# Altium schematic sheet CAN_ADM3053.SchDoc
size 420 x 297 mm; Address1: Address1; Address2: Address2; Address3: Address3; Address4: Address4; SheetNumber: 1; Scale: 1:1; Обозначение документа: АБВГ.123456.001 Э3
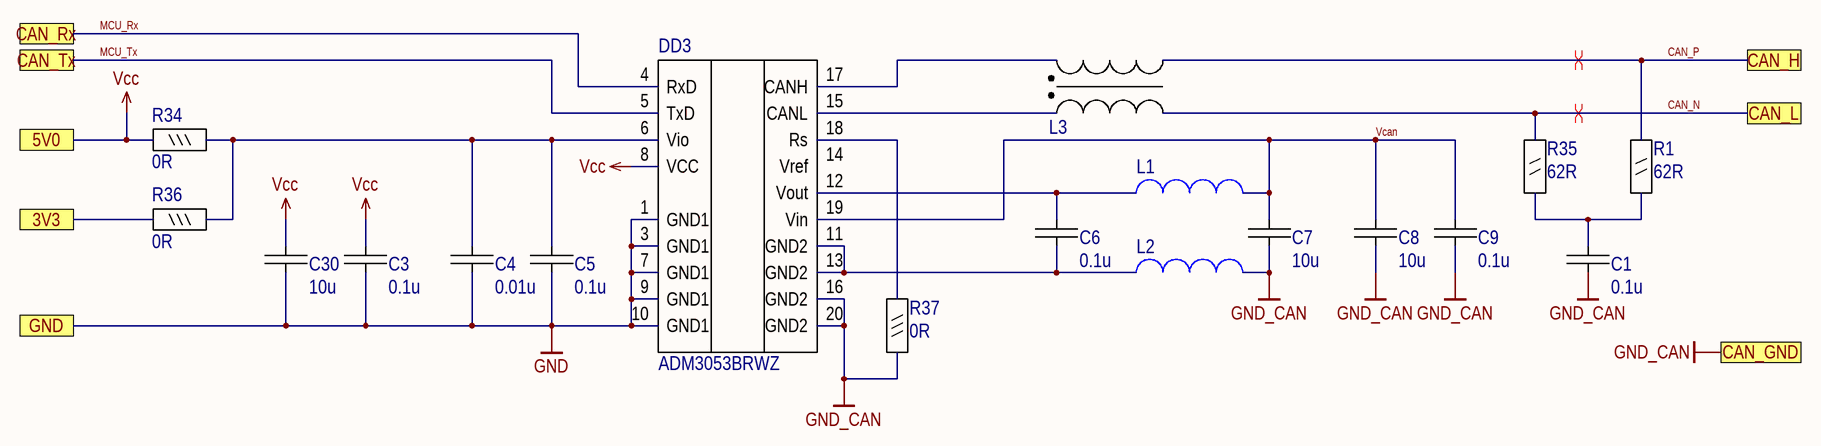
[diagram p0: CAN_ADM3053.SchDoc]

## Parts
C1  0.1u  [C0603_IPC]
C3  0.1u  [C0603_IPC]
C4  0.01u  [C0603_IPC]
C5  0.1u  [C0603_IPC]
C6  0.1u  [C0603_IPC]
C7  10u  [C0805_IPC]
C8  10u  [C0805_IPC]
C9  0.1u  [C0603_IPC]
C30  10u  [C0805_IPC]
DD3  ADM3053BRWZ  [SOIC20W]
L1  BLM18AG102SN1D  [ind0603]  (value not drawn)
L2  BLM18AG102SN1D  [ind0603]  (value not drawn)
L3  DLW21SN900SQ2L  [DLW21S 0805]  (value not drawn)
R1  62R  [R0805]
R34  0R  [R0603]
R35  62R  [R0805]
R36  0R  [R0603]
R37  0R  [R0603]

## Ports
3V3, 5V0, CAN_GND, CAN_H, CAN_L, CAN_Rx, CAN_Tx, GND

## Nets
GND: C3.2 C4.2 C5.2 C30.2 DD3.1(GND1) DD3.3(GND1) DD3.7(GND1) DD3.9(GND1) DD3.10(GND1) ; port GND
GND_CAN: C1.2 C7.2 C8.2 C9.2 DD3.16(GND2) DD3.20(GND2) L2.2 R37.1 ; port CAN_GND
Vcc: C3.1 C30.1 DD3.8(VCC) R34.2 ; port 5V0
3V3: R36.2 ; port 3V3
CAN_N: L3.3 R35.2 ; port CAN_L
CAN_P: L3.2 R1.2 ; port CAN_H
MCU_Rx: DD3.4(RxD) ; port CAN_Rx
MCU_Tx: DD3.5(TxD) ; port CAN_Tx
Vcan: C7.1 C8.1 C9.1 DD3.19(Vin) L1.2
NetC1_1: C1.1 R1.1 R35.1
NetC4_1: C4.1 C5.1 DD3.6(Vio) R34.1 R36.1
NetC6_1: C6.1 DD3.12(Vout) L1.1
NetC6_2: C6.2 DD3.11(GND2) DD3.13(GND2) L2.1
NetDD3_15: DD3.15(CANL) L3.4
NetDD3_17: DD3.17(CANH) L3.1
NetDD3_18: DD3.18(Rs) R37.2

Not connected (* = marked no-connect by the designer): DD3 2(NC) 14(Vref)

## Layout directives
differential pair: CAN_N, CAN_P

## Notes on the sheet
- Подп. и дата
- Инв. № дубл.
- Взам. инв. №
- Инв. № подл.
- Изм.
- Лист
- № докум.
- Подп.
- Дата
- Копировал
- Формат А3

## Library data of the parts
C1 C3 C5 C6 C9 = 0.1u 50V: 0.1uF ±10% 50V Ceramic Capacitor X7R 0603 (1608 Metric); MPN: CL10B104KB8NNND; Manufacturer: Samsung; Tolerance: 0,1; PartNumber: 0.1u 50V; Value: 0.1u; Voltage/Power: 50V; LibraryPath: _library\sch\cap.schlib; FootprintPath: _library\pcb\capSmd.pcblib; ComponentLink2URL: https://www.digikey.com/product-detail/en/yageo/CC0603KRX7R9BB104/311-1344-2-ND/2103082; ComponentLink2Description: site; Type: X7R; price elitan 1000pc: 0.63; price terra 1000pc: 0.65
C4 = 0.01u 50V: 0.01uF ±10% 50V Ceramic Capacitor X7R 0603 (1608 Metric); MPN: CC0603KRX7R9BB103; Manufacturer: Yageo; Tolerance: 0,1; PartNumber: 0.01u 50V; Value: 0.01u; Voltage/Power: 50V; LibraryPath: _library\sch\cap.schlib; FootprintPath: _library\pcb\capSmd.pcblib; ComponentLink2URL: https://www.digikey.com/product-detail/en/yageo/CC0603KRX7R9BB103/311-1085-2-ND/302819; ComponentLink2Description: site; Type: X7R; price elitan 1000pc: 0.54; price terra 1000pc: 0.62
C7 C8 C30 = 10u 10V: 10µF ±10% 10V Ceramic Capacitor X7R 0805 (2012 Metric); PartNumber: 10u 10V; MPN: CL21B106KPQNNNE; Manufacturer: Yageo; Tolerance: 0,1; Value: 10u; Voltage/Power: 10V; LibraryPath: _library\sch\cap.schlib; FootprintPath: _library\pcb\capSmd.pcblib; ComponentLink2URL: https://www.digikey.com/product-detail/en/samsung-electro-mechanics/CL21B106KPQNNNE/1276-1764-2-ND/3887422; ComponentLink2Description: site; Type: X7R; price elitan 1000pc: 2.23; price terra 1000pc: 2.5
DD3 = ADM3053: DGTL ISO 2.5KV 2CH CAN 20SOIC; Component Package: SOIC, 20-Leads, Body 12,80x7,50mm, Pitch 1,27mm, IPC Medium Density; Component Name: ADM3053BRWZ; HelpURL: C:\DATASHEET\Driver\ADM3053.pdf; ComponentLink1Description: DataSheet; ComponentLink1URL: C:\DATASHEET\Driver\ADM3053.pdf; Name: ADM3053; MPN: ADM3053BRWZ; ComponentLink2URL: https://www.analog.com/media/en/technical-documentation/data-sheets/ADM3053.pdf; ComponentLink2Description: site; LibraryPath: _library\sch; FootprintPath: _library\pcb; ComponentLink3URL: http://pulsarnpp.ru/index.php/2-uncategorised/236-seriya-1432nov; ComponentLink3Description: 1432УД8; ComponentLink4URL: http://www.ti.com/product/opa694/description; ComponentLink4Description: OPA658
L1 L2 = BLM18AG102: 1 kOhms @ 100MHz 1 Ferrite Bead 0603 (1608 Metric) 400mA 500 mOhm; Manufacturer: Murata Electronics North America; Value: 18mH, 400mA 500 mOhm; Tolerance: ±25%; MPN: BLM18AG102SN1D; PartNumber: BLM18AG102; Voltage/Power: 400mA 500 mOhm; ComponentLink2URL: https://www.digikey.com/product-detail/en/murata-electronics-north-america/BLM18AG102SN1D/490-1015-2-ND/584226; ComponentLink2Description: site; price elitan 1000pc: 0.65; price terra 1000pc: 0.96; price chipdip 1000pc: 6; price dart 1000pc: 1; LibraryPath: _library\sch\inductors.schlib; FootprintPath: _library\pcb\inductor.pcblib
L3 = DLW21SN900SQ2L: 2 Line Common Mode Choke Surface Mount 90 Ohms @ 100MHz 330mA DCR 350 mOhm; Manufacturer: Murata; F21: D:\_library\pdf\cap\G0N_NP0.pdf; F22: NPO; F23: D:\_library\pdf\cap\X5R.pdf; F24: X5R; PartNumber: DLW21SN900SQ2L; MPN: DLW21SN900SQ2L; Value: 90 Ohms @ 100MHz; Voltage/Power: 330mA DCR 350 mOhm; ComponentLink2URL: https://www.digikey.com/product-detail/en/murata-electronics-north-america/DLW21SN900SQ2L/490-5137-2-ND/1922871; ComponentLink2Description: site; price elitan 1000pc: 4.81; price terra 1000pc: 6.1; price chipdip 1000pc: 13; LibraryPath: _library\sch\cap.schlib; FootprintPath: _library\pcb\capSmd.pcblib
R1 R35 = 62R 5%: 62 Ohms ±5% 0.125W, 1/8W Chip Resistor 0805 (2012 Metric) Moisture Resistant Thick Film; MPN: RC0805JR-0762RL; Manufacturer: yageo; Name: 62R 5%; Tolerance: 0,05; Voltage/Power: 0.125; Value: 62R; ComponentLink2URL: https://www.digikey.com/product-detail/en/yageo/RC0805JR-0762RL/311-62ARTR-ND/728359; ComponentLink2Description: site; price elitan 1000pc: 0.26; price terra 1000pc: 0.23; LibraryPath: _library\sch\res.schlib; FootprintPath: _library\pcb\resSmd.pcblib
R34 R36 R37 = 0R: 0 Ohms Jumper 0.1W, 1/10W Chip Resistor 0603 (1608 Metric) Moisture Resistant Thick Film; MPN: RC0603FR-070RL; Manufacturer: yageo; Voltage/Power: 0.063; PartNumber: 0R; Value: 0R; Tolerance: Jumper; ComponentLink2URL: https://www.digikey.com/product-detail/en/yageo/RC0603FR-070RL/311-0.0HRTR-ND/1304008; ComponentLink2Description: site; price elitan 1000pc: 0.26; price terra 1000pc: 0.23; LibraryPath: _library\sch\; FootprintPath: _library\pcb\resSmd.pcblib